# Altium project pcb_sample_1.PrjPcb
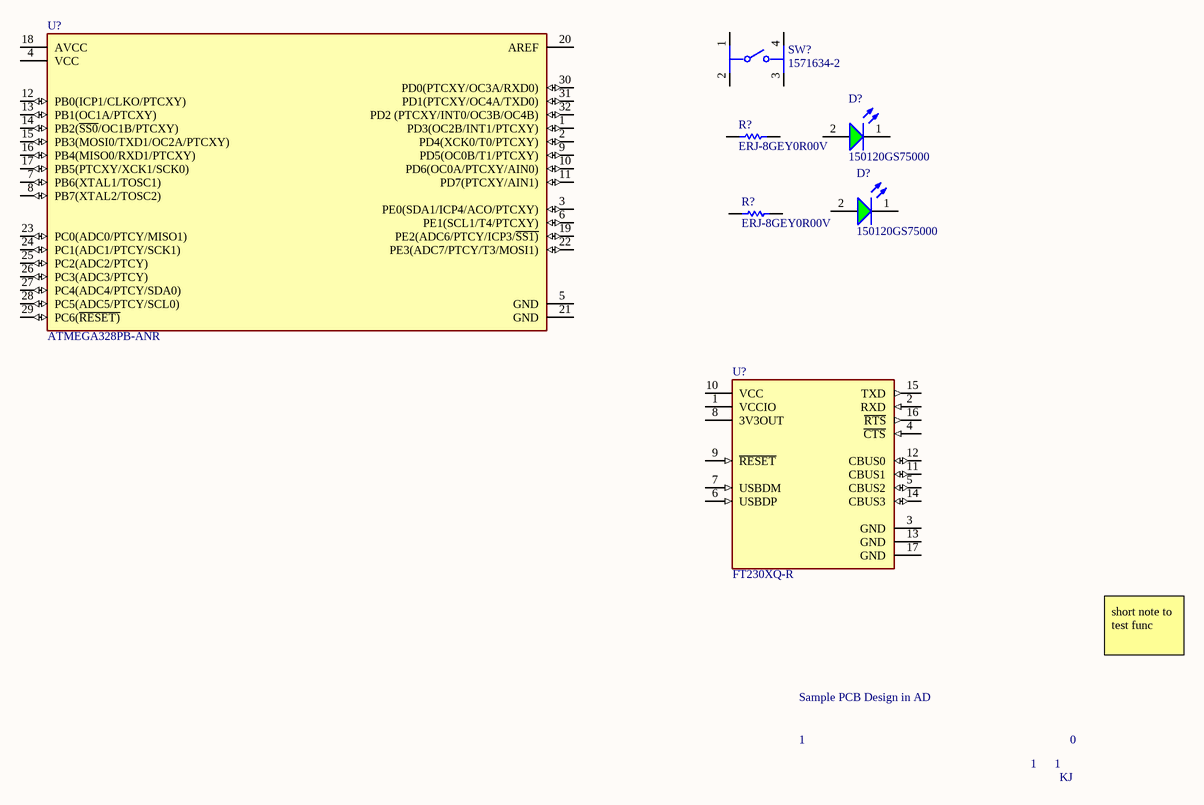
[diagram p0: pcb_sample_sch.SchDoc]
1 sheet, 7 parts. Net scope: global (net labels, ports and power ports of the same name join across sheets).

## Sheet pcb_sample_sch.SchDoc
size A4; SheetNumber: 1; SheetTotal: 1

### Parts
(Parts that share a designator on the sheet are numbered #1, #2 ... from top to bottom, then left to right.)
D?#1  150120GS75000  [WL-SMCW_1206_150120xx75000]
D?#2  150120GS75000  [WL-SMCW_1206_150120xx75000]
R?#1  ERJ-8GEY0R00V  [RESC3216X70X50NL05T20]
R?#2  ERJ-8GEY0R00V  [RESC3216X70X50NL05T20]
SW?  1571634-2  [FP-1571634-2-MFG]
U?#1  ATMEGA328PB-ANR  [FP-C04-074-MFG]
U?#2  FT230XQ-R  [FP-QFN-16-MFG]

### Nets

Not connected (* = marked no-connect by the designer): D?#1 1(K) 2(A); D?#2 1(K) 2(A); R?#1 1 2; R?#2 1 2; SW? 1 2 3 4; U?#1 1(PD3(OC2B/INT1/PTCXY)) 2(PD4(XCK0/T0/PTCXY)) 3(PE0(SDA1/ICP4/ACO/PTCXY)) 4(VCC) 5(GND) 6(PE1(SCL1/T4/PTCXY)) 7(PB6(XTAL1/TOSC1)) 8(PB7(XTAL2/TOSC2)) 9(PD5(OC0B/T1/PTCXY)) 10(PD6(OC0A/PTCXY/AIN0)) 11(PD7(PTCXY/AIN1)) 12(PB0(ICP1/CLKO/PTCXY)) 13(PB1(OC1A/PTCXY)) 14(PB2(~{SS0}/OC1B/PTCXY)) 15(PB3(MOSI0/TXD1/OC2A/PTCXY)) 16(PB4(MISO0/RXD1/PTCXY)) 17(PB5(PTCXY/XCK1/SCK0)) 18(AVCC) 19(PE2(ADC6/PTCY/ICP3/~{SS1)}) 20(AREF) 21(GND) 22(PE3(ADC7/PTCY/T3/MOSI1)) 23(PC0(ADC0/PTCY/MISO1)) 24(PC1(ADC1/PTCY/SCK1)) 25(PC2(ADC2/PTCY)) 26(PC3(ADC3/PTCY)) 27(PC4(ADC4/PTCY/SDA0)) 28(PC5(ADC5/PTCY/SCL0)) 29(PC6(~{RESET)}) 30(PD0(PTCXY/OC3A/RXD0)) 31(PD1(PTCXY/OC4A/TXD0)) 32(PD2_(PTCXY/INT0/OC3B/OC4B)); U?#2 1(VCCIO) 2(RXD) 3(GND) 4(~{CTS}) 5(CBUS2) 6(USBDP) 7(USBDM) 8(3V3OUT) 9(~{RESET}) 10(VCC) 11(CBUS1) 12(CBUS0) 13(GND) 14(CBUS3) 15(TXD) 16(~{RTS}) 17(GND)

### Notes on the sheet
- Sample PCB Design in AD
- short note to test func
- 1
- 0
- KJ

### Library data of the parts
D?#1 D?#2 = CMP-1426-00014-3: NexarPartId: 29717787; Peak Wavelength: 515nm; Wavelength: 520nm; Test Current: 20mA; Dominant Wavelength: 525nm; Luminous Intensity: 450mcd; Max Junction Temperature (Tj): 95°C; Power Dissipation: 105mW; Reverse Voltage: 5V; Forward Current: 100mA; Viewing Angle: 140°; Forward Voltage: 3.2V; Lens Style: Clear, Rectangular; Color: Green; Width: 1.6mm; Case Code (Metric): 3216; Mount: Surface Mount; Min Operating Temperature: -40°C; Packaging: Tape and Reel; Length: 3.2mm; REACH SVHC: Unknown; Max Reverse Voltage (DC): 5V; Case/Package: 1206; Height: 680µm; Case Code (Imperial): 1206; RoHS: Compliant; Max Operating Temperature: 85°C
R?#1 R?#2 = CMP-2003-00541-1: Manufacturer: Panasonic; Part Number: ERJ-8GEY0R00V
SW? = CMP-03407-000008-1: SWITCH TACTILE SPST-NO 0.05A 24V; Actuator Length: 0.094inch; Max Current Rating: 50mA; Voltage Rating (DC): 12V; Actuator Material: Rubber; Switch Function: Off-Mom; Mechanical Life: 5000000Cycles; Actuator Type: Standard; Actuator Color: Natural; Illumination Type: Illuminated; Operating Force: 160gf; Throw Configuration: SPST; Package Quantity: 1000; Max Operating Temperature: 85°C; Mount: Surface Mount; Contact Plating: Silver; Depth: 10mm; Min Operating Temperature: -40°C; Radiation Hardening: No; ELV: Compliant; Case/Package: SMD/SMT; Length: 6.2mm; Termination: Gull Wing; Type: Switch; RoHS Compliant: Yes; Current Rating: 50mA; Contact Current Rating: 50mA; Orientation: Straight; Packaging: Tape and Reel; Max Voltage Rating (DC): 12V; Lead Free: Lead Free; Contact Material: Stainless Steel
U?#1 = CMP-06276-000131-1: IC MCU 8BIT 32KB FLASH 32TQFP; RoHS Compliant: Yes
U?#2 = CMP-0248-00010-3: IC USB SERIAL BASIC UART 16QFN; Number of Channels: 1; Data Rate: 12Mbps; Operating Supply Current: 8mA; Max Supply Voltage: 5.5V; Operating Supply Voltage: 5V; Min Supply Voltage: 2.97V; Width: 4mm; Length: 4mm; Height: 0.75mm; Max Operating Temperature: 85°C; Interface: USB; Min Operating Temperature: -40°C; Package Quantity: 5000; Lead Free: Lead Free; Number of Pins: 16; Case/Package: QFN; Weight: 0.002014oz; Packaging: Tape and Reel; Mount: Surface Mount